# Altium schematic sheet POWER_CON.SchDoc
size A4
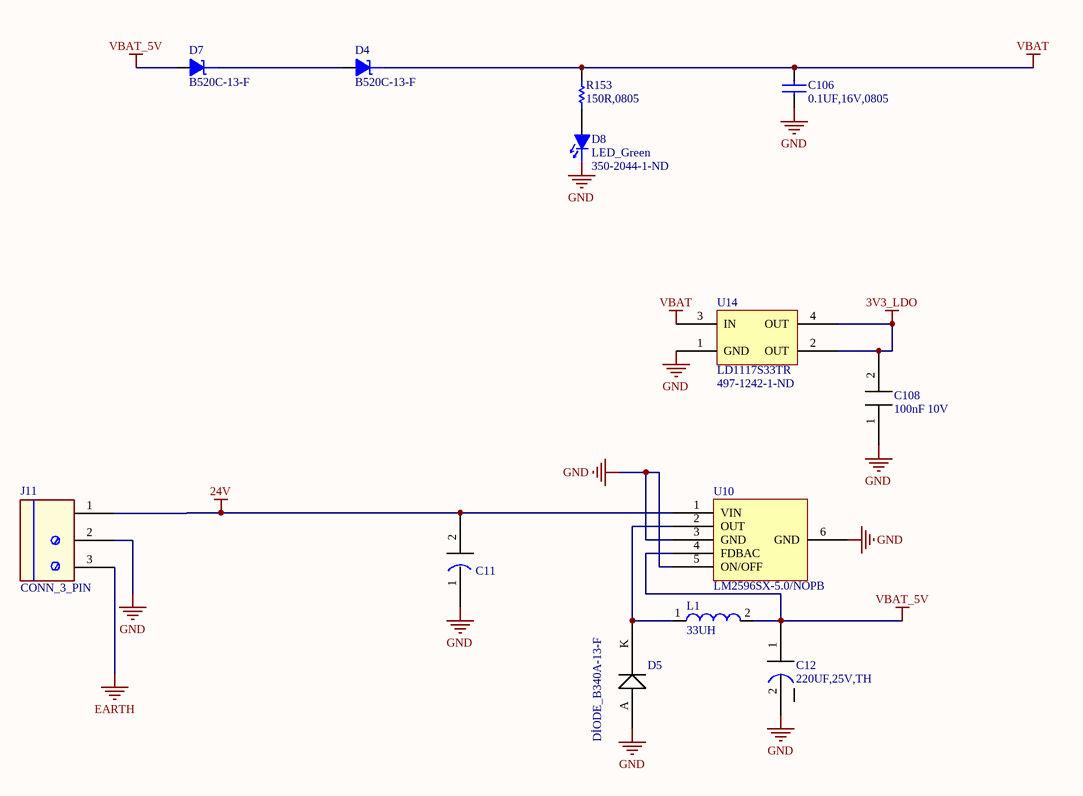
[diagram p0: POWER_CON.SchDoc]

## Parts
C11  EKZE500ELL681MK30S  [HEADER,2PİN]  (value not drawn)
C12  220UF,25V,TH  [TH]
C106  0.1UF,16V,0805  [0805]
C108  100nF 10V  [0805]
D4  B520C-13-F  [B520C-13-F]
D5  DİODE_B340A-13-F  [Diode]
D7  B520C-13-F  [B520C-13-F]
D8  LED_Green  Supplier Part Number 1: 350-2044-1-ND  [LED_0805]
J11  CONN_3_PIN  [CON_3]
L1  33UH  [indkrt_2]
R153  150R,0805  [0805]
U10  LM2596SX-5.0/NOPB  [TO-263-5]
U14  LD1117S33TR  Supplier Part Number 1: 497-1242-1-ND  [SOT-223_L]

## Nets
3V3_LDO: C108.2 U14.2(OUT) U14.4(OUT)
24V: C11.2 J11.1 U10.1(VIN)
EARTH: J11.3
GND: C11.1 C12.2 C106.1 C108.1 D5.A D8.1(Cathode) J11.2 U10.3(GND) U10.5(ON/OFF) U10.6(GND) U14.1(GND)
VBAT: C106.2 D4.1(CATHODE) R153.2 U14.3(IN)
VBAT_5V: C12.1 D7.2(ANODE) L1.2 U10.4(FDBAC)
NetD4_2: D4.2(ANODE) D7.1(CATHODE)
NetD5_K: D5.K L1.1 U10.2(OUT)
NetD8_2: D8.2(Anode) R153.1

## Library data of the parts
C11 = EKZE500ELL681MK30S: Aluminium Electrolytic Capacitors - Leaded 50volts 680uF 12.5X30; Manufacturer: United Chemi-Con; Tolerance: 20 %; Voltage Rating DC: 50 V; Case Diameter: 12.5 mm; Case Length: 30 mm; Supplier 1: Mouser; Manufacturer Part Number: EKZE500ELL681MK30S; RoHS: RoHS Compliant; Category: Aluminium Electrolytic Capacitors - Leaded; Stock 1: 2082; Pricing 1: 1=1.12, 10=0.886, 100=0.591, 500=0.502, 1000=0.443, 2000=0.413, 5000=0.398, 10000=0.384, 25000=0.374 (USD); Capacitance: 680 uF; Dimensions: 12.5 mm Dia. x 30 mm L; Packaging: Bulk; Product: Low Impedance Electrolytic Capacitors; Series: KZE; Termination Style: Radial; Brand: United Chemi-Con; Lead Spacing: 5 mm; Maximum Operating Temperature: + 105 C; Product Category: Aluminum Electrolytic Capacitors; Standard Pack Qty: 1000; RoHS - Mouser: Y; Minimum Order Quantity: 1; Reeling: False; ComponentLink1URL: http://www.mouser.com/ds/2/420/al-kze-e-140701-514740.pdf; ComponentLink1Description: http://www.mouser.com/ds/2/420/al-kze-e-140701-514740.pdf; Supplier Part Number 1: 661-EKZE500ELL681MK3
C12 = 220UF,25V,TH: Manufacturer: Panasonic; Manufacturer Part Number: EEU-FC1E221B; Tolerance: 20 %; Type: Radial Lead Type; ESR: 117 mOhms; Case Diameter: 8 mm; Case Length: 11 mm; Load Life: 2000 h; Ripple Current: 555 mA; Supplier 1: Mouser; RoHS: RoHS Compliant; Category: Aluminium Electrolytic Capacitors - Leaded; Stock 1: 1648; Pricing 1: 1=0.471, 10=0.231, 100=0.149, 1000=0.126, 2000=0.112, 10000=0.102, 25000=0.099, 50000=0.097 (USD); Capacitance: 220 uF; Dimensions: 8 mm Dia. x 11 mm L; Packaging: Ammo Pack; Product: High Temp Electrolytic Capacitors; Series: FC; Termination Style: Radial; Voltage Rating DC: 25 V; Brand: Panasonic; Lead Spacing: 5 mm; Maximum Operating Temperature: + 105 C; Standard Pack Qty: 1000; RoHS - Mouser: Y; Minimum Order Quantity: 1; Reeling: False; ComponentLink1URL: http://www.mouser.com/ds/2/315/ABA0000CE22-68457.pdf; ComponentLink1Description: http://www.mouser.com/ds/2/315/ABA0000CE22-68457.pdf; Supplier Part Number 1: 667-EEU-FC1E221B
C106 = 0.1UF,16V,0805: AVX - 0805YC104KAT2A - CAP, MLCC, X7R, 100NF, 16V, 0805; Capacitance: 0.1; Capacitance Tolerance: ± 10%; Dielectric Characteristic: X7; Voltage Rating: 16; Ceramic Capacitor Case: 0805 [2012 Metric]; SVHC: No SVHC (16-Jun-2014); Capacitor Case Style: 0805 [2012 Metric]<!--FANDB--><div class="features-and-benefits-container"></div>; Tolerance: ±10%; Supplier 1: Digi-Key; Manufacturer: AVX; Manufacturer Part Number: 0805YC104KAT2A; RoHS: YES; Stock 1: 9101; Pricing 1: 1=0.29, 10=0.198, 100=0.1008, 250=0.0816, 500=0.072, 1000=0.0612 (USD); Product Range: -; Operating Temperature Min: -55; Operating Temperature Max: 125; Packaging: Cut Tape; MSL: MSL 1 - Unlimited; Capacitance Tolerance ±: ± 10%; ComponentLink1URL: http://www.farnell.com/datasheets/1679506.pdf; ComponentLink1Description: http://www.farnell.com/datasheets/1679506.pdf; Supplier Part Number 1: 478-7961-1-ND; Category: Capacitors; Voltage - Rated: 16V; Temperature Coefficient: X7R; Mounting Type: Surface Mount, MLCC; Operating Temperature: -55°C ~ 125°C; Applications: General Purpose; Ratings: -; Package / Case: 0805 (2012 Metric); Size / Dimension: 0.079" L x 0.049" W (2.00mm x 1.25mm); Height - Seated (Max): -; Thickness (Max): 0.037" (0.94mm); Lead Spacing: -; Features: -; Lead Style: -; ComponentLink2URL: http://www.avx.com/docs/Catalogs/cx7r.pdf; ComponentLink2Description: http://www.avx.com/docs/Catalogs/cx7r.pdf
C108 = 100nF 10V 8055C104JAT2A: AVX - 08055C104JAT2A - CAP, MLCC, X7R, 100NF, 50V, 0805; Capacitance: 0.1; Capacitance Tolerance: ± 5%; Dielectric Characteristic: X7; Voltage Rating: 50; Ceramic Capacitor Case: 0805 [2012 Metric]; SVHC: No SVHC (16-Jun-2014); Capacitor Terminals: SMD; External Depth: 1.25; External Length / Height: 0.5; External Width: 2.01; No. of Pins: 2; No. of Channels: 4; Isolation Voltage: 2.5; CTR Min: 50%; Forward Current If Max: 30; Optocoupler Case Style: SSOP; Input Current: 5; Optocoupler Output Type: Phototransistor; Output Voltage: 80; Tolerance: ±5%; Supplier 1: Digi-Key; Manufacturer: AVX; Manufacturer Part Number: 08055C104JAT2A; RoHS: YES; Stock 1: 205492; Pricing 1: 1=0.15, 10=0.1, 100=0.0475, 250=0.04, 500=0.0335, 1000=0.0275 (USD); Product Range: -; Operating Temperature Min: -55; Operating Temperature Max: 125; Packaging: Cut Tape; MSL: MSL 1 - Unlimited; Capacitance Tolerance ±: ± 5%; Capacitor Case Style: 0805 [2012 Metric]; Operating Temperature Range: -55°C to +125; Series: MLCC<!--FANDB--><div class="features-and-benefits-container"></div>; ComponentLink1URL: http://www.farnell.com/datasheets/1679506.pdf; ComponentLink1Description: http://www.farnell.com/datasheets/1679506.pdf; ComponentLink2URL: http://www.farnell.com/cad/1614383.zip; ComponentLink2Description: http://www.farnell.com/cad/1614383.zip; Supplier Part Number 1: 478-3352-1-ND; ComponentLink3URL: http://www.farnell.com/datasheets/1825494.pdf; ComponentLink3Description: http://www.farnell.com/datasheets/1825494.pdf; ComponentLink4URL: http://www.farnell.com/datasheets/89583.pdf; ComponentLink4Description: http://www.farnell.com/datasheets/89583.pdf; Category: Capacitors; Voltage - Rated: 50V; Temperature Coefficient: X7R; Mounting Type: Surface Mount, MLCC; Operating Temperature: -55°C ~ 125°C; Applications: General Purpose; Ratings: -; Package / Case: 0805 (2012 Metric); Size / Dimension: 0.079" L x 0.049" W (2.01mm x 1.25mm); Height - Seated (Max): -; Thickness (Max): 0.037" (0.94mm); Lead Spacing: -; Features: -; Lead Style: -; ComponentLink5URL: http://www.avx.com/docs/Catalogs/cx7r.pdf; ComponentLink5Description: http://www.avx.com/docs/Catalogs/cx7r.pdf
D4 D7 = Diode_5ARect: Diode Power Rectifier 5A Schottky; Mfr: Diodes Inc; TIIntPartnumber: 1E0012; Vendor: Digikey; Cost100: 0.17; Cost10K: 0.09; DescriptiveText: Diode Power Rectifier 5A Schottky; PartName: Diode_5ARect; MfrNum: B520C-13-F; Descriptive_Text: Diode Power Rectifier 5A Schottky; Supplier 1: Digi-Key; Supplier Part Number 1: B520C-FDITR-ND
D5 = DİODE_B340A-13-F: MULTICOMP - B340A-13-F - DIODE, RECTIFIER, 3A, 40V, DO-214AC; Supplier 1: Farnell; Manufacturer: MULTICOMP; Manufacturer Part Number: B340A-13-F; RoHS: YES; Stock 1: 9862; Pricing 1: 1=0,28, 10=0,166, 50=0,125, 100=0,117, 500=0,109, 1000=0,101 (EUR); ComponentLink1URL: http://www.farnell.com/datasheets/1693726.pdf; ComponentLink1Description: http://www.farnell.com/datasheets/1693726.pdf; Supplier Part Number 1: 2306401
D8 = LED_Green: LED Green SMD 20mA 2V 0805; TIIntPartnumber: 1F0008; MfrNum: 598-8170-107F; Mfr: Dialight; PartName: LEDGreen2x1.5; Cost10K: 0.052; Cost100: 0.081; Vendor: Digikey; Wavelength - Dominant: 566nm; Millicandela Rating: 20mcd; Viewing Angle: 140°; Lens Type: Clear; Lens Style/Size: Rectangle with Flat Top, 1.4mm x 1.25mm; DescriptiveText: LED Green SMD 20mA 2V 0805; Descriptive_Text: LED Green SMD 20mA 2V 0805; Supplier 1: Digi-Key; Manufacturer: Dialight; Manufacturer Part Number: 598-8170-107F; RoHS: RoHS Compliant; Category: Optoelectronics; Stock 1: 91030; Pricing 1: 1=0.42, 10=0.31, 25=0.248, 100=0.1643, 250=0.1364, 500=0.0992, 1000=0.0775 (USD); Packaging: Cut Tape (CT); Color: Green; Wavelength - Peak: -; Voltage - Forward (Vf) (Typ): 2V; Current - Test: 20mA; Package / Case: 0805 (2012 Metric); Size / Dimension: 2.00mm L x 1.25mm W; Height: 0.70mm; Mounting Type: Surface Mount; Luminous Flux @ Current - Test: -; ComponentLink1URL: http://media.digikey.com/pdf/Data%20Sheets/Dialight%20PDFs/598_Series_0805_Pkg.pdf; ComponentLink1Description: http://media.digikey.com/pdf/Data%20Sheets/Dialight%20PDFs/598_Series_0805_Pkg.pdf
L1 = SRR1260-330M: Fixed Inductors 33uH 20% SMD 1260; Manufacturer: Bourns; Maximum DC Current: 3 A; Maximum DC Resistance: 60 mOhms; Q Minimum: 27; Self Resonant Frequency: 9.97 MHz; Shielding: Shielded; Type: Shielded Power Inductor; Case Height: 6 mm; Case Length: 12.5 mm; Supplier 1: Mouser; Manufacturer Part Number: SRR1260-330M; RoHS: RoHS Compliant; Category: Fixed Inductors; Stock 1: 3279; Pricing 1: 1=0.972, 10=0.853, 50=0.730, 100=0.694, 250=0.634, 600=0.439, 1200=0.437 (USD); Inductance: 33 uH; Operating Temperature Range: - 40 C to + 125 C; Package/Case: 1260; Packaging: Reel; Product: Power Inductors; Series: SRR1260; Termination Style: SMD/SMT; Tolerance: 20 %; Brand: Bourns; Case Width: 12.5 mm; Product Category: Shielded Power Inductors; Standard Pack Qty: 600; RoHS - Mouser: Y; Minimum Order Quantity: 1; Reeling: True; ComponentLink1URL: http://www.mouser.com/ds/2/54/SRR1260-59143.pdf; ComponentLink1Description: http://www.mouser.com/ds/2/54/SRR1260-59143.pdf; Supplier Part Number 1: 652-SRR1260-330M
R153 = 150R,0805: TE CONNECTIVITY / NEOHM - CPF0805B150RE1 - RESISTOR, 0805, 150R; Product Range: TE CONNECTIVITY - CPF Series; Resistance: 150; Power Rating: 100; Resistance Tolerance: ± 0.1%; Resistor Case Style: 0805 [2012 Metric]; Resistor Element Material: Thin Film; Temperature Coefficient: ± 25; Voltage Rating: 200; External Depth: 0.5; External Length / Height: 2; External Width: 1.25; Resistor Mounting: SMD; Tolerance: ±5%; Power (Watts): 0.125W, 1/8W; Supplier 1: Digi-Key; Manufacturer: TE CONNECTIVITY / NEOHM; Manufacturer Part Number: CPF0805B150RE1; RoHS: YES; Stock 1: 143875; Pricing 1: 1=0.1, 10=0.021, 50=0.0116, 100=0.0088, 250=0.00652, 500=0.0048, 1000=0.0032, 2500=0.0027 (USD); Packaging: Cut Tape; MSL: -; No. of Pins: 2; Operating Temperature Max: 155; Operating Temperature Min: -55; Operating Temperature Range: -55°C to +155; Series: CPF<!--FANDB--><div class="features-and-benefits-container"></div>; ComponentLink1URL: http://www.tycoelectronics.com/commerce/DocumentDelivery/DDEController?Action=srchrtrv&DocNm=1614884&DocType=Customer+Drawing&DocLang=English; ComponentLink1Description: http://www.tycoelectronics.com/commerce/DocumentDelivery/DDEController?Action=srchrtrv&DocNm=1614884&DocType=Customer+Drawing&DocLang=English; ComponentLink2URL: http://www.tycoelectronics.com/commerce/DocumentDelivery/DDEController?Action=srchrtrv&DocNm=1773200&DocType=Data+Sheet&DocLang=English; ComponentLink2Description: http://www.tycoelectronics.com/commerce/DocumentDelivery/DDEController?Action=srchrtrv&DocNm=1773200&DocType=Data+Sheet&DocLang=English; Supplier Part Number 1: RMCF0805JT150RCT-ND; Category: Resistors; Resistance (Ohms): 150; Composition: Thick Film; Features: -; Operating Temperature: -55°C ~ 155°C; Package / Case: 0805 (2012 Metric); Supplier Device Package: 0805; Size / Dimension: 0.079" L x 0.049" W (2.00mm x 1.25mm); Height: 0.026" (0.65mm); Number of Terminations: 2; ComponentLink3URL: http://www.seielect.com/Catalog/SEI-RMCF_RMCP.pdf; ComponentLink3Description: http://www.seielect.com/Catalog/SEI-RMCF_RMCP.pdf
U10 = LM2596SX-5.0/NOPB: Voltage Regulators - Switching Regulators 150 KHZ 3A STEP-DOWN VLTG REG; Manufacturer: Texas Instruments; Input Voltage MAX: 40 V; Number of Outputs: 1 Output; Output Voltage: 5 V; Switching Frequency: 173 kHz; Topology: Buck; Input Voltage MIN: 4.5 V; Supplier 1: Mouser; Manufacturer Part Number: LM2596SX-5.0/NOPB; RoHS: RoHS Compliant; Category: Voltage Regulators - Switching Regulators; Stock 1: 1902; Pricing 1: 1=4.45, 10=3.98, 25=3.57, 50=3.42, 100=3.26, 250=2.94, 500=2.64, 1000=2.39, 1500=2.03 (USD); Operating Temperature Range: - 40 C to + 85 C; Output Current: 3 A; Package/Case: TO-263-5; Packaging: Reel; Series: LM2596; Type: Inverting, Step Down; Brand: Texas Instruments; Mounting Style: SMD/SMT; Maximum Operating Temperature: + 125 C; Minimum Operating Temperature: - 40 C; Standard Pack Qty: 500; RoHS - Mouser: Y; Minimum Order Quantity: 1; Reeling: True; ComponentLink1URL: http://www.mouser.com/ds/2/405/snvs124c-317006.pdf; ComponentLink1Description: http://www.mouser.com/ds/2/405/snvs124c-317006.pdf; Supplier Part Number 1: 926-LM2596SX-5.0NOPB
U14 = LD1117S33TR: STMICROELECTRONICS - LD1117S33TR - IC, LDO VOLT REG, 3.3V, 0.8A, SOT-223-3; Regulator Topology: Positive Fixed; Current - Output: 800mA; Voltage - Dropout (Typical): 1.1V @ 800mA; Number of Regulators: 1; Voltage - Input: Up to 15V; Supplier 1: Digi-Key; Manufacturer: STMICROELECTRONICS; Manufacturer Part Number: LD1117S33TR; RoHS: YES; Stock 1: 36493; Pricing 1: 1=0.55, 10=0.434, 25=0.366, 100=0.2983, 250=0.24704, 500=0.20408, 1000=0.14985 (USD); ComponentLink1URL: http://www.st.com/internet/com/TECHNICAL_RESOURCES/TECHNICAL_LITERATURE/PACKING_INFORMATION/CD00148931.pdf; ComponentLink1Description: http://www.st.com/internet/com/TECHNICAL_RESOURCES/TECHNICAL_LITERATURE/PACKING_INFORMATION/CD00148931.pdf; ComponentLink2URL: http://www.farnell.com/datasheets/1776449.pdf; ComponentLink2Description: http://www.farnell.com/datasheets/1776449.pdf; ComponentLink3URL: http://www.farnell.com/cad/1724370.zip; ComponentLink3Description: http://www.farnell.com/cad/1724370.zip; Category: Integrated Circuits (ICs); Packaging: Cut Tape (CT); Voltage - Output: 3.3V; Current - Limit (Min): -; Operating Temperature: 0°C ~ 125°C; Mounting Type: Surface Mount; Package / Case: TO-261-4, TO-261AA; Supplier Device Package: SOT-223; ComponentLink4URL: http://www.st.com/web/en/resource/technical/document/datasheet/CD00000544.pdf; ComponentLink4Description: http://www.st.com/web/en/resource/technical/document/datasheet/CD00000544.pdf